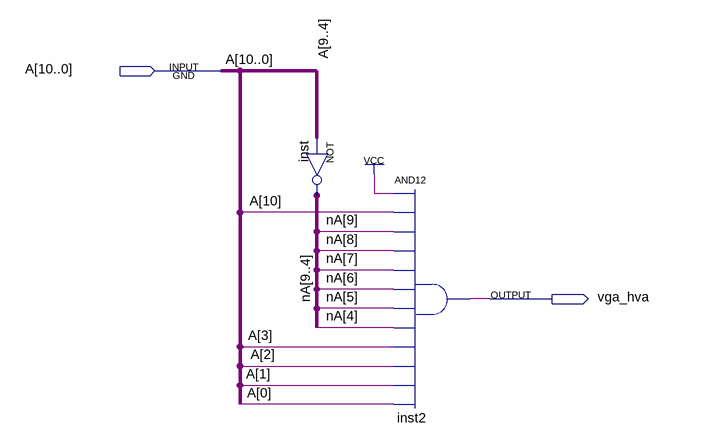
[diagram p0: schematic sheet]
// Quartus schematic vga_hva.bdf as structural Verilog: 2 symbols, 2 pins
module vga_hva (
  input  [10:0] A,
  output vga_hva
);

  wire [9:4] nA;

  assign nA = ~A[9:4];  // NOT inst, 6 bits wide
  and inst2 (vga_hva, 1'b1, A[10], nA[9], nA[8], nA[7], nA[6], nA[5], nA[4], A[3], A[2], A[1], A[0]);
endmodule
